# EAGLE design H03 (EAGLE 6.6.0)

## Sheet 1 of 3
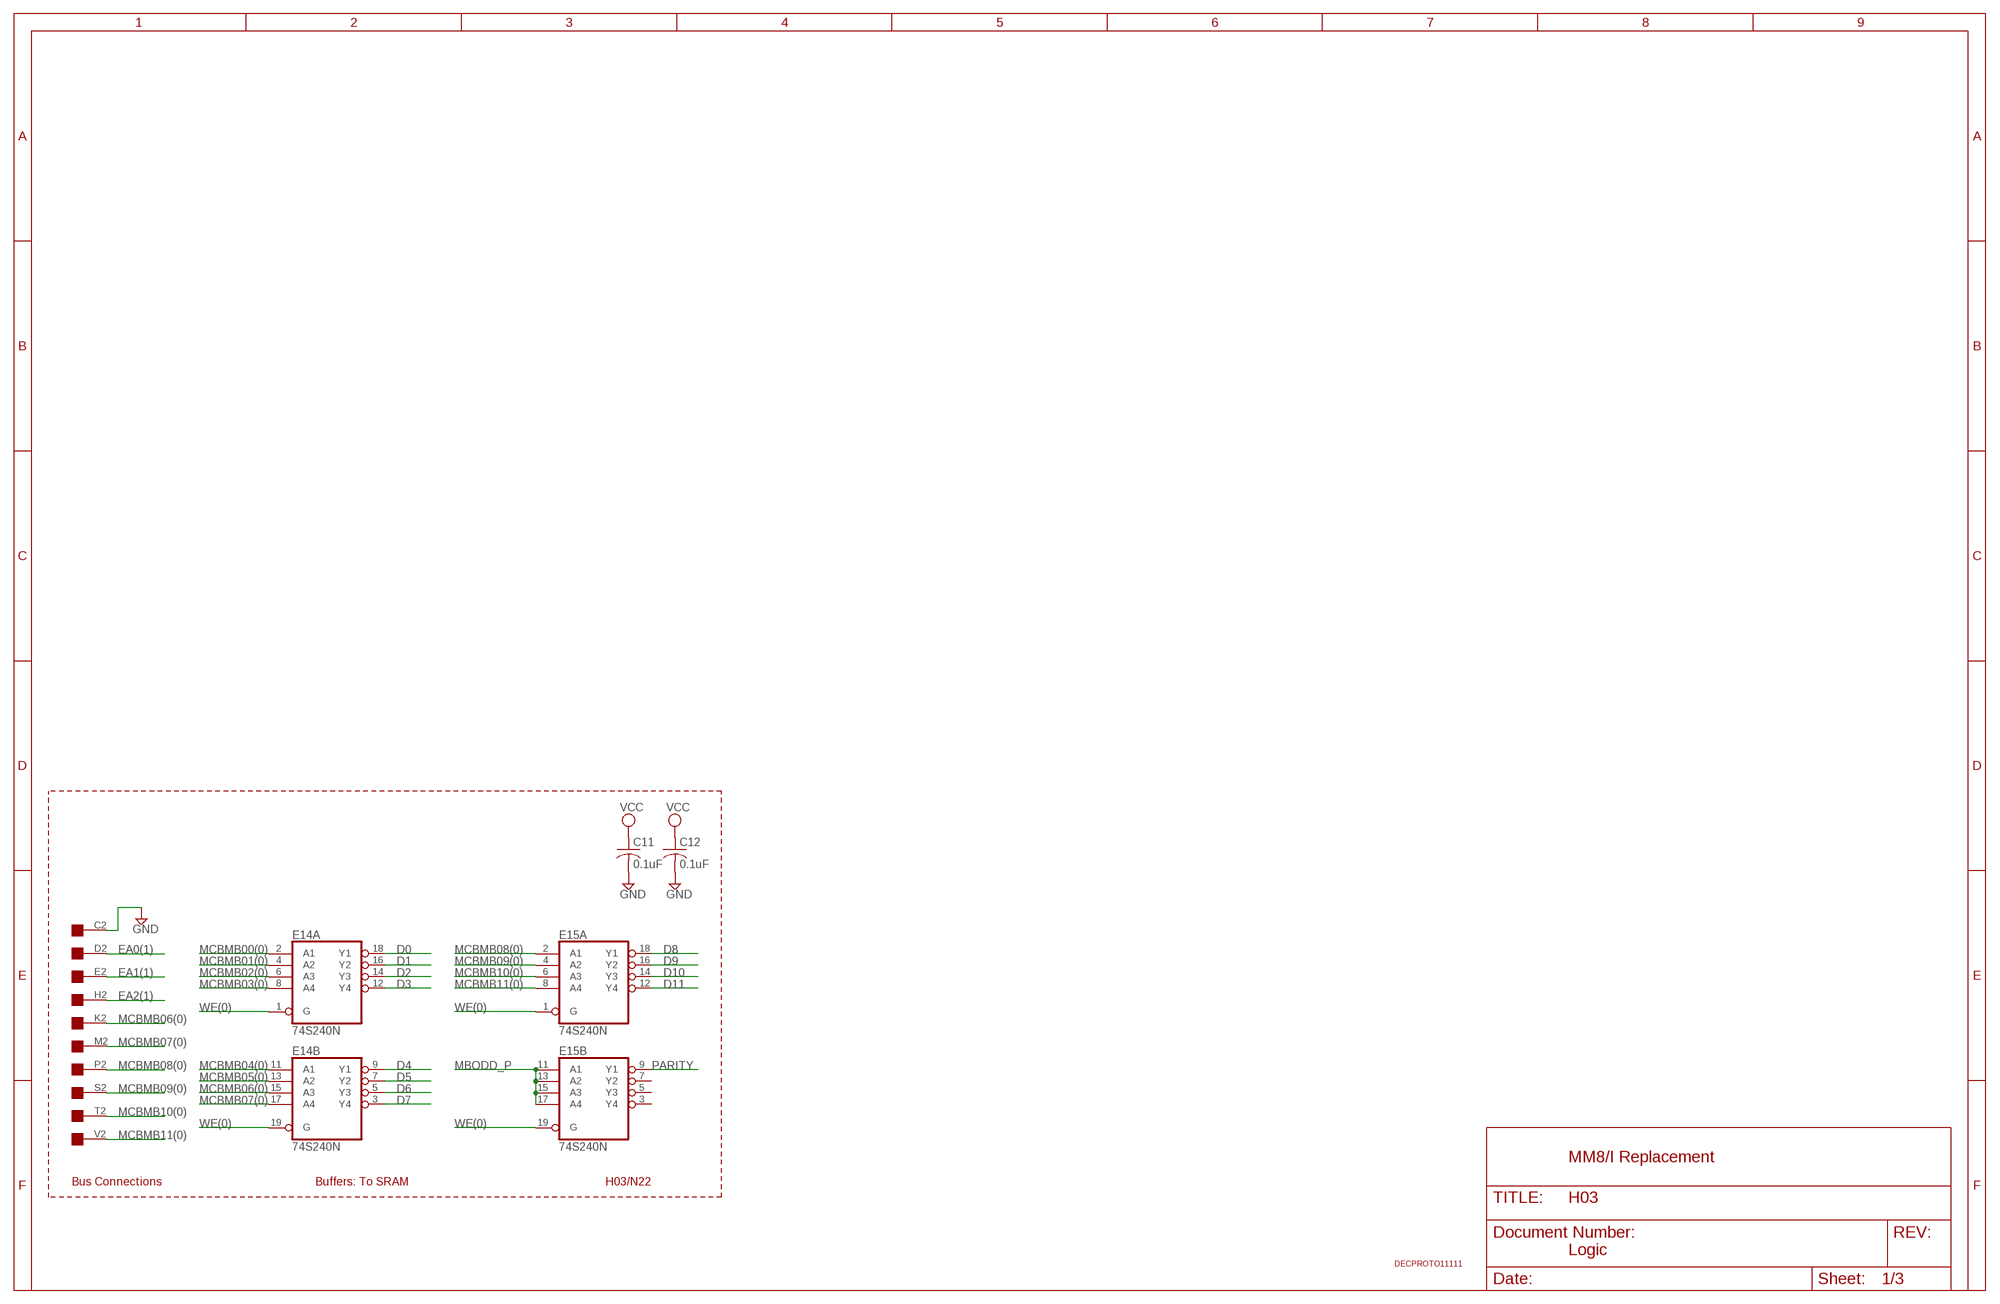
[diagram p0: schematic, sheet 1]

### Parts
C11  0.1uF  C-US050-025X075  [C050-025X075]
C12  0.1uF  C-US050-025X075  [C050-025X075]
E14  74S240N  [DIL20]
E15  74S240N  [DIL20]
H03  EDGE-1  [EDGE-CON1]
U$6  DECPROTO11111  [DECPROTO11111]

### Nets
D0: E14.18(A:Y1) ; also sheet 2
D1: E14.16(A:Y2) ; also sheet 2
D2: E14.14(A:Y3) ; also sheet 2
D3: E14.12(A:Y4) ; also sheet 2
D4: E14.9(B:Y1) ; also sheet 2
D5: E14.7(B:Y2) ; also sheet 2
D6: E14.5(B:Y3) ; also sheet 2
D7: E14.3(B:Y4) ; also sheet 2
D8: E15.18(A:Y1) ; also sheet 2
D9: E15.16(A:Y2) ; also sheet 2
D10: E15.14(A:Y3) ; also sheet 2
D11: E15.12(A:Y4) ; also sheet 2
EA0(1): H03.D2 ; also sheet 2
EA1(1): H03.E2 ; also sheet 2
EA2(1): H03.H2 ; also sheet 2
GND [supply]: C11.2 C12.2 H03.C2 ; also sheet 2
MBODD_P: E15.11(B:A1) E15.13(B:A2) E15.15(B:A3) E15.17(B:A4) ; also sheet 2
MCBMB00(0): E14.2(A:A1) ; also sheet 2
MCBMB01(0): E14.4(A:A2) ; also sheet 2
MCBMB02(0): E14.6(A:A3) ; also sheet 2
MCBMB03(0): E14.8(A:A4) ; also sheet 2
MCBMB04(0): E14.11(B:A1) ; also sheet 2
MCBMB05(0): E14.13(B:A2) ; also sheet 2
MCBMB06(0): E14.15(B:A3) H03.K2
MCBMB07(0): E14.17(B:A4) H03.M2
MCBMB08(0): E15.2(A:A1) H03.P2
MCBMB09(0): E15.4(A:A2) H03.S2
MCBMB10(0): E15.6(A:A3) H03.T2
MCBMB11(0): E15.8(A:A4) H03.V2
PARITY: E15.9(B:Y1) ; also sheet 2
VCC [supply]: C11.1 C12.1 ; also sheet 2
WE(0): E14.1(A:G) E14.19(B:G) E15.1(A:G) E15.19(B:G) ; also sheet 2
Unconnected: E15.3(B:Y4) E15.5(B:Y3) E15.7(B:Y2) H03.A2 H03.B2 H03.F2 H03.J2 H03.L2 H03.N2 H03.R2 H03.U2

### Notes on the sheet
- MM8/I Replacement
- Bus Connections | Buffers: To SRAM | H03/N22
- Logic

## Sheet 2 of 3
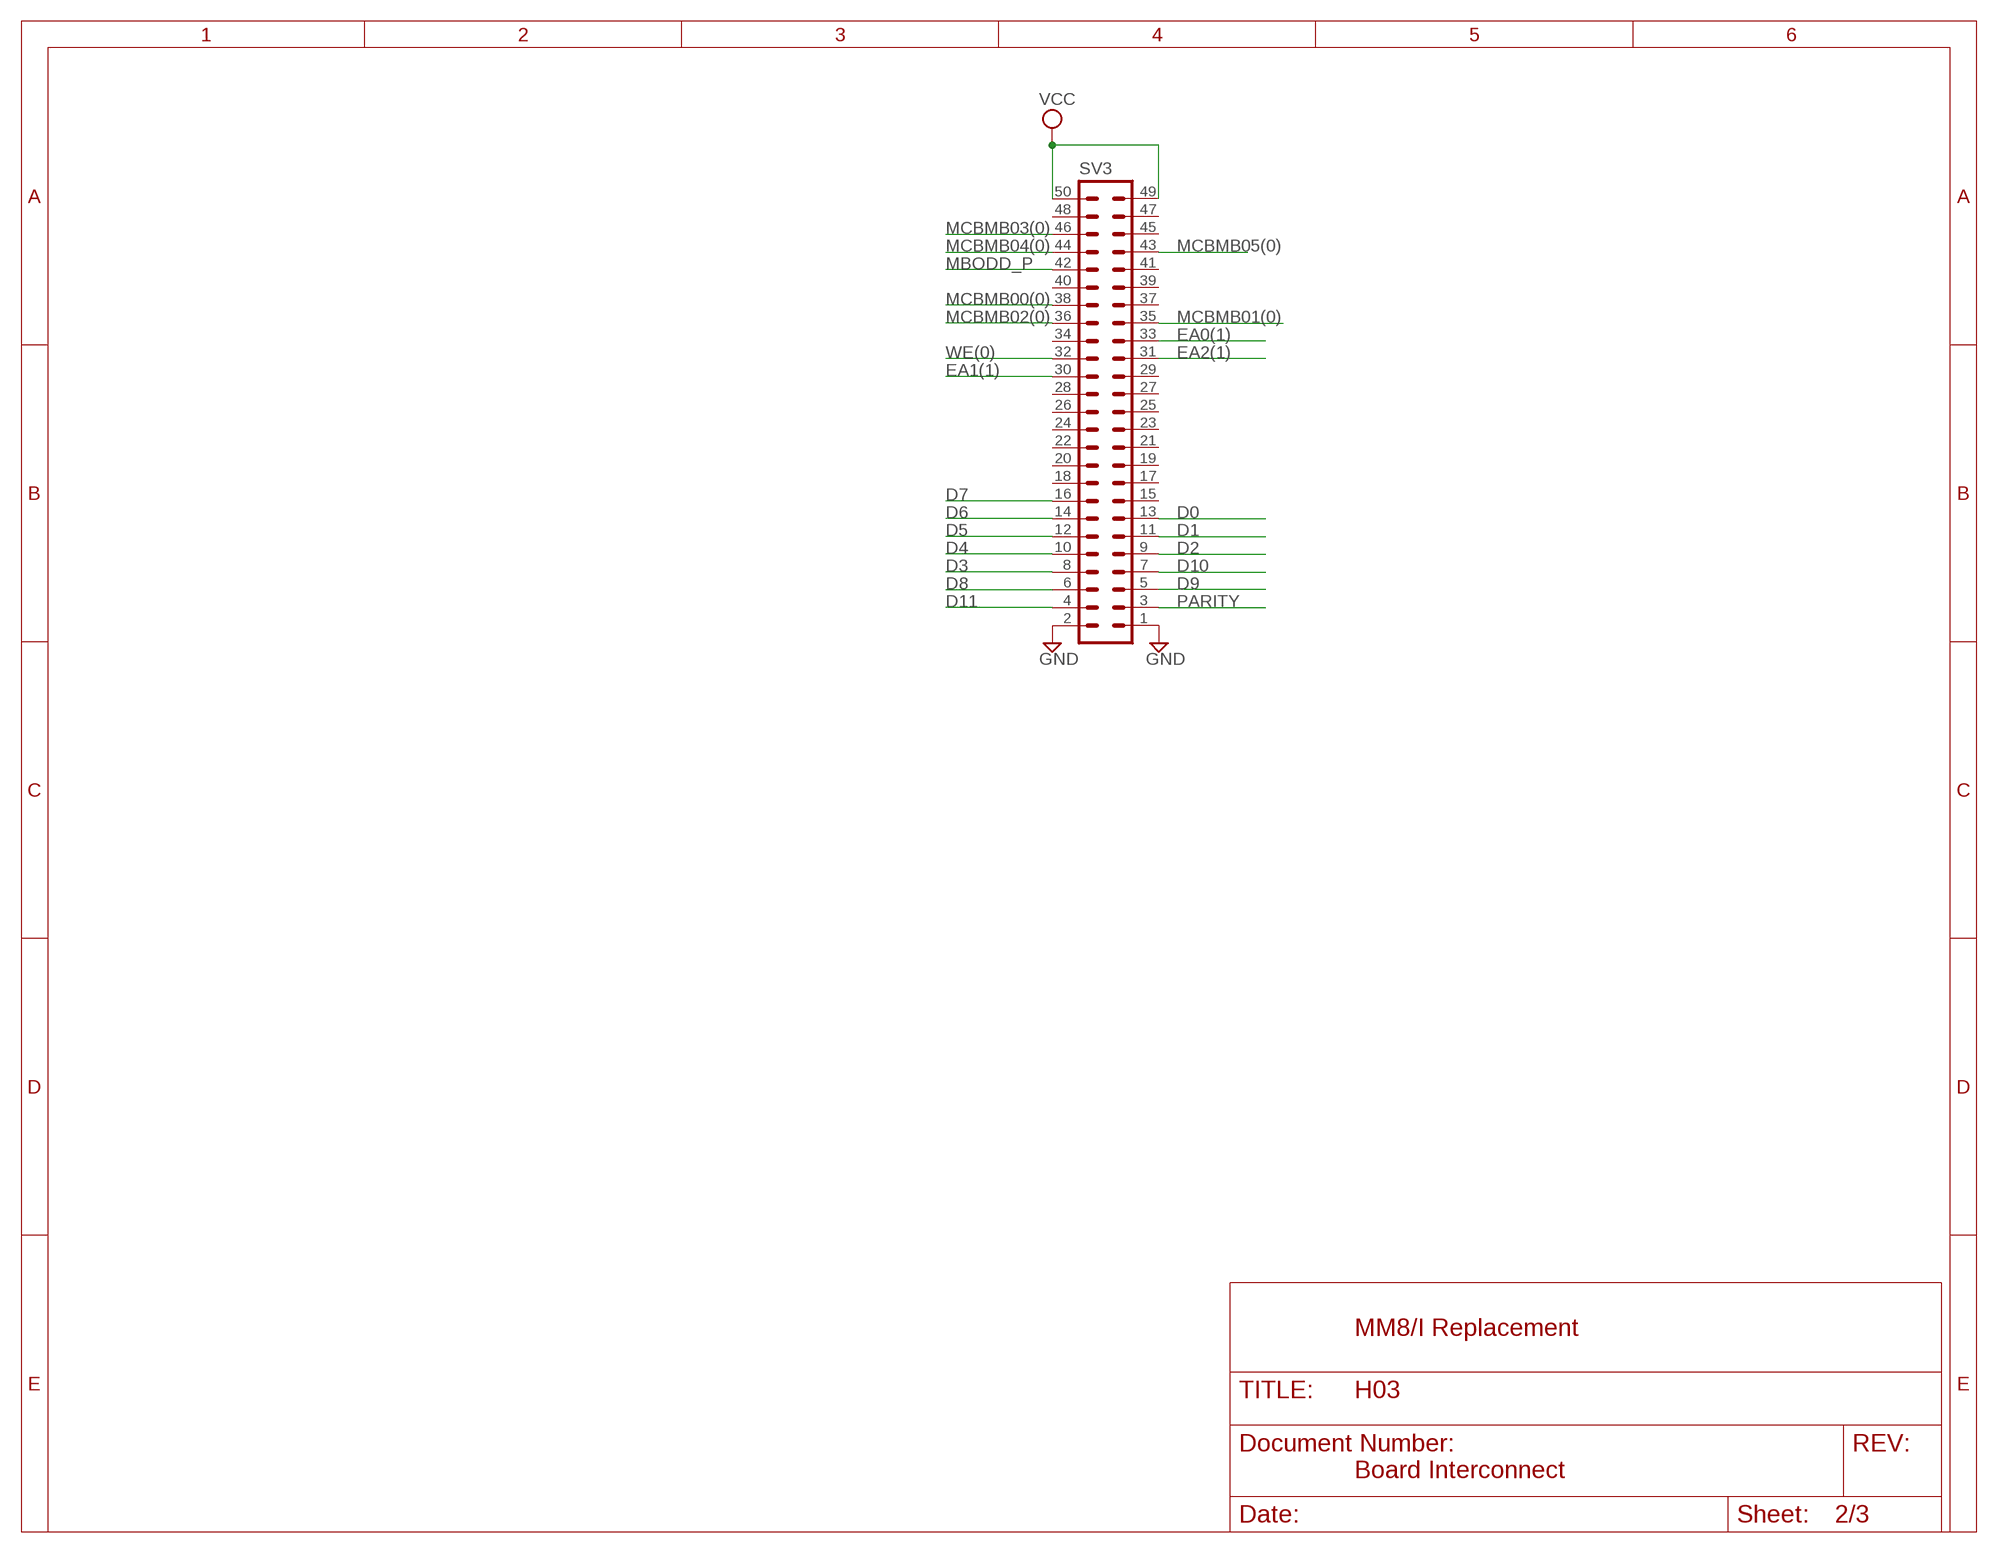
[diagram p1: schematic, sheet 2]

### Parts
SV3  ML50L  [ML50L]

### Nets
D0: SV3.13 ; also sheet 1
D1: SV3.11 ; also sheet 1
D2: SV3.9 ; also sheet 1
D3: SV3.8 ; also sheet 1
D4: SV3.10 ; also sheet 1
D5: SV3.12 ; also sheet 1
D6: SV3.14 ; also sheet 1
D7: SV3.16 ; also sheet 1
D8: SV3.6 ; also sheet 1
D9: SV3.5 ; also sheet 1
D10: SV3.7 ; also sheet 1
D11: SV3.4 ; also sheet 1
EA0(1): SV3.33 ; also sheet 1
EA1(1): SV3.30 ; also sheet 1
EA2(1): SV3.31 ; also sheet 1
GND [supply]: SV3.1 SV3.2 ; also sheet 1
MBODD_P: SV3.42 ; also sheet 1
MCBMB00(0): SV3.38 ; also sheet 1
MCBMB01(0): SV3.35 ; also sheet 1
MCBMB02(0): SV3.36 ; also sheet 1
MCBMB03(0): SV3.46 ; also sheet 1
MCBMB04(0): SV3.44 ; also sheet 1
MCBMB05(0): SV3.43 ; also sheet 1
PARITY: SV3.3 ; also sheet 1
VCC [supply]: SV3.49 SV3.50 ; also sheet 1
WE(0): SV3.32 ; also sheet 1
Unconnected: SV3.15 SV3.17 SV3.18 SV3.19 SV3.20 SV3.21 SV3.22 SV3.23 SV3.24 SV3.25 SV3.26 SV3.27 SV3.28 SV3.29 SV3.34 SV3.37 SV3.39 SV3.40 SV3.41 SV3.45 SV3.47 SV3.48

### Notes on the sheet
- MM8/I Replacement
- Board Interconnect

## Sheet 3 of 3
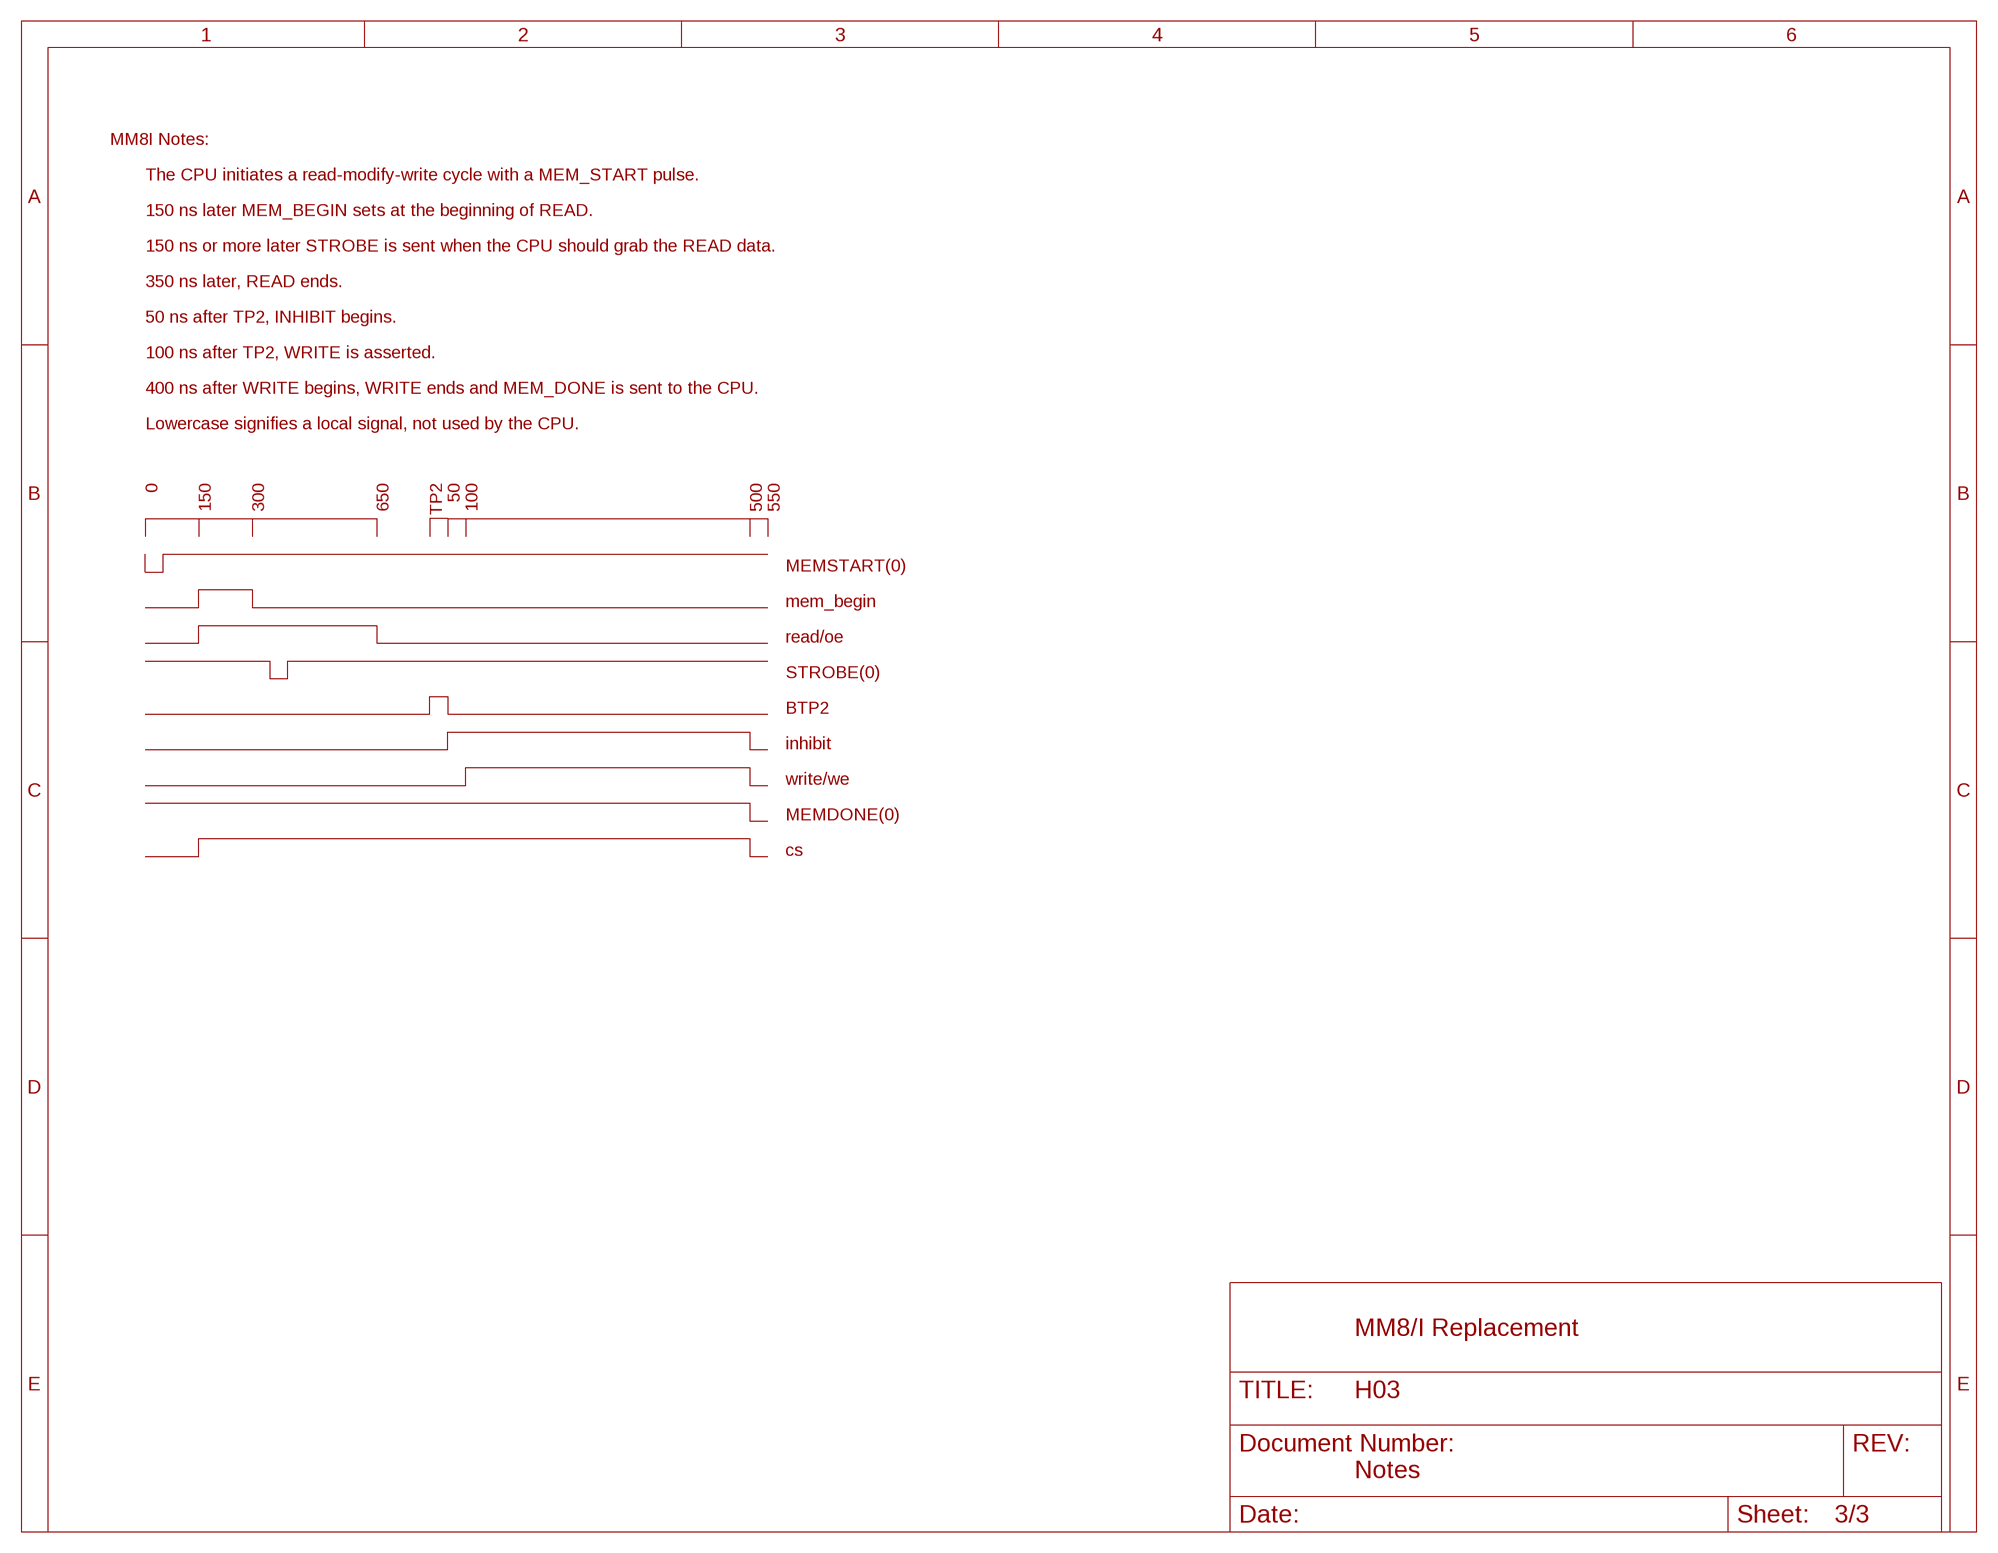
[diagram p2: schematic, sheet 3]

### Notes on the sheet
- MM8I Notes:
- The CPU initiates a read-modify-write cycle with a MEM_START pulse.
- 150 ns later MEM_BEGIN sets at the beginning of READ.
- 150 ns or more later STROBE is sent when the CPU should grab the READ data.
- 350 ns later, READ ends.
- 50 ns after TP2, INHIBIT begins.
- 100 ns after TP2, WRITE is asserted.
- 400 ns after WRITE begins, WRITE ends and MEM_DONE is sent to the CPU.
- Lowercase signifies a local signal, not used by the CPU.
- 0 | 150 | 300 | 650 | TP2 | 50 | 100 | 500 | 550
- MEMSTART(0)
- mem_begin
- read/oe
- STROBE(0)
- BTP2
- inhibit
- write/we
- MEMDONE(0)
- cs
- MM8/I Replacement
- Notes

## Power pins joined to a net without a drawn wire
GND: E14.10(P:GND) E15.10(P:GND)
VCC: E14.20(P:VCC) E15.20(P:VCC)

## Library data of the parts
C11 C12 = rcl:C-US: CAPACITOR, American symbol
E14 E15 = 74xx-us:74*240: Octal BUFFER and LINE DRIVER, 3-state
H03 = dec-con:EDGE-1: Single-Sided DEC Edge Connector -- (side 2)
SV3 = con-ml:ML50L: HARTING; OC_FARNELL: unknown; OC_NEWARK: unknown
U$6 = dec-con:DECPROTO: Various small DEC boards stuck together with break-away tab routing.

## Net classes
1 supply: width 0.711 mm

## Board
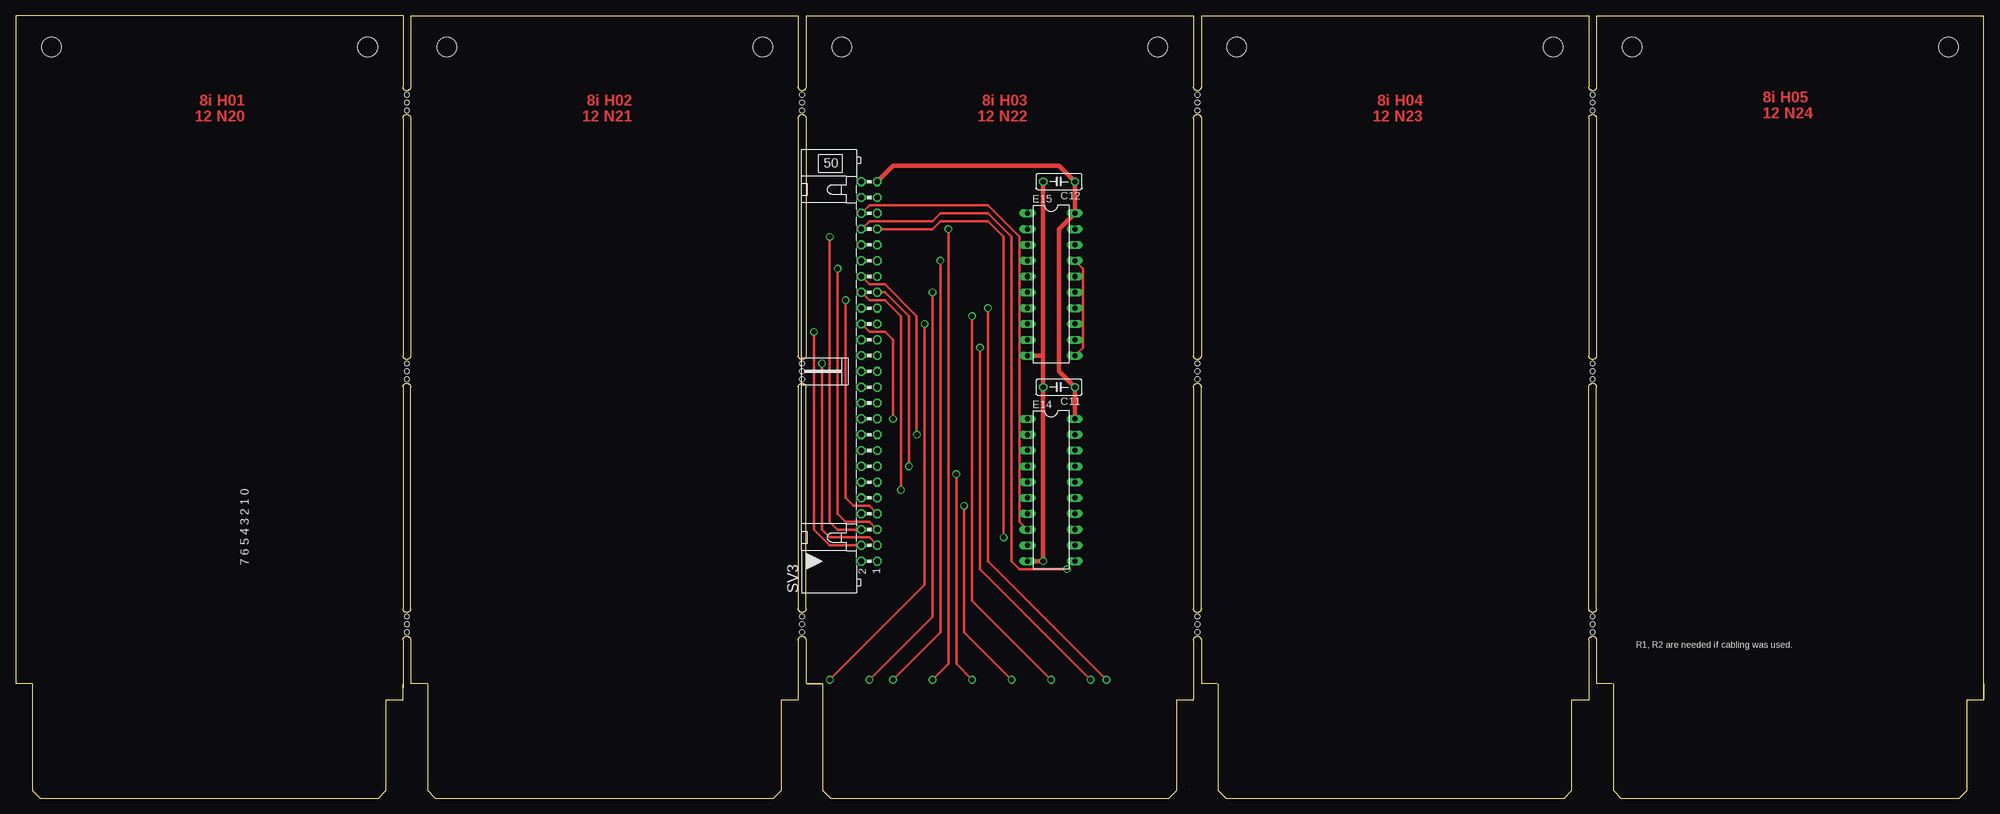
[diagram p3: board, top side]
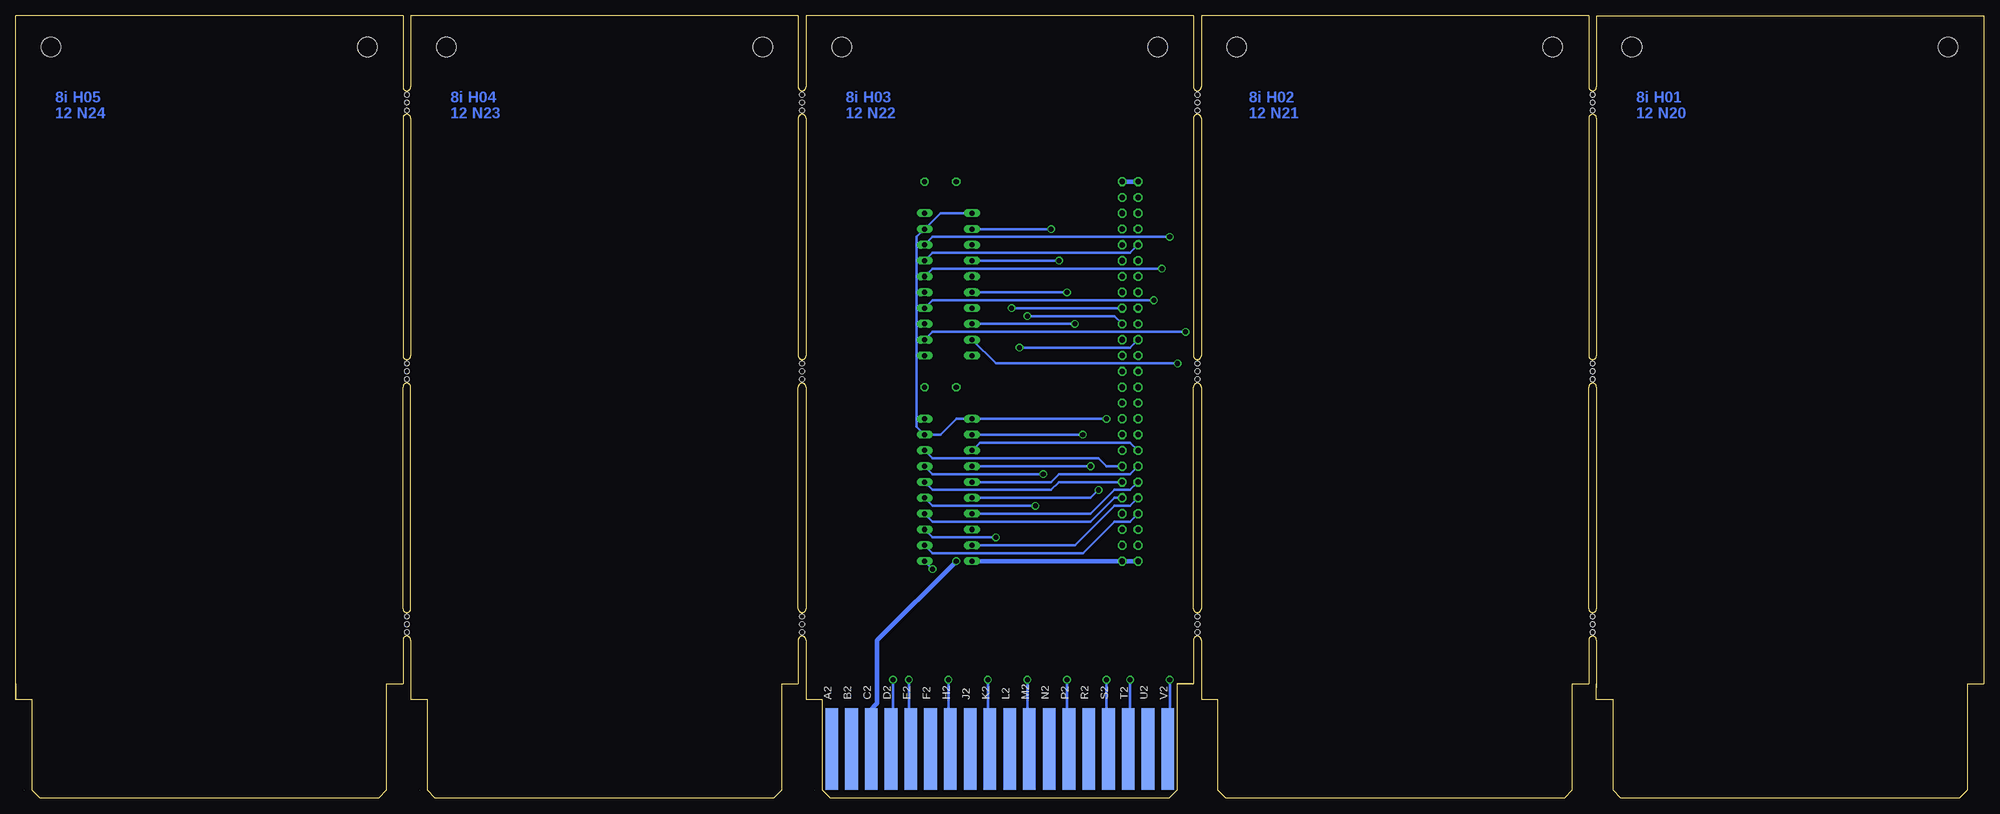
[diagram p4: board, bottom side, seen from below]

Size 316.23 x 125.73 mm. Coordinates in mm from the lower left corner, seen from the top.
Copper layers (1+16): Top 0.035mm / dielectric 1.5mm / Bottom 0.035mm
Design rules "16mils": minimum track width 16mil, minimum drill 32mil, track to track 15mil, track to pad 10mil, pad to pad 10mil, via to via 10mil, smd to smd 10mil, copper to edge 13mil, drill to drill 10mil, minimum pad ring 10mil, minimum via ring 8mil, stop-mask expansion 0mil, vias tented up to drill 0mil, thermal gap 10mil

### Footprints (pad centres in the part's own frame; a part is rotated, then mirrored left to right if it is on the bottom)
C050-025X075 = drill 0.813 octagon: 1 -2.54,0; 2 2.54,0
DIL20 = drill 0.813 long: 1 -11.43,-3.81; 2 -8.89,-3.81; 3 -6.35,-3.81; 4 -3.81,-3.81; 5 -1.27,-3.81; 6 1.27,-3.81; 7 3.81,-3.81; 8 6.35,-3.81; 9 8.89,-3.81; 10 11.43,-3.81; 11 11.43,3.81; 12 8.89,3.81; 13 6.35,3.81; 14 3.81,3.81; 15 1.27,3.81; 16 -1.27,3.81; 17 -3.81,3.81; 18 -6.35,3.81; 19 -8.89,3.81; 20 -11.43,3.81
EDGE-CON1 = smd 13.106 x 2.032 bottom: A2 7.938,4.128; B2 7.938,7.303; C2 7.938,10.477; D2 7.938,13.652; E2 7.938,16.828; F2 7.938,20.003; H2 7.938,23.177; J2 7.938,26.352; K2 7.938,29.527; L2 7.938,32.703; M2 7.938,35.877; N2 7.938,39.053; P2 7.938,42.227; R2 7.938,45.403; S2 7.938,48.578; T2 7.938,51.752; U2 7.938,54.928; V2 7.938,58.102
ML50L = drill 0.914 octagon: 1 -30.48,-1.27; 2 -30.48,1.27; 3 -27.94,-1.27; 4 -27.94,1.27; 5 -25.4,-1.27; 6 -25.4,1.27; 7 -22.86,-1.27; 8 -22.86,1.27; 9 -20.32,-1.27; 10 -20.32,1.27; 11 -17.78,-1.27; 12 -17.78,1.27; 13 -15.24,-1.27; 14 -15.24,1.27; 15 -12.7,-1.27; 16 -12.7,1.27; 17 -10.16,-1.27; 18 -10.16,1.27; 19 -7.62,-1.27; 20 -7.62,1.27; 21 -5.08,-1.27; 22 -5.08,1.27; 23 -2.54,-1.27; 24 -2.54,1.27; 25 0,-1.27; 26 0,1.27; 27 2.54,-1.27; 28 2.54,1.27; 29 5.08,-1.27; 30 5.08,1.27; 31 7.62,-1.27; 32 7.62,1.27; 33 10.16,-1.27; 34 10.16,1.27; 35 12.7,-1.27; 36 12.7,1.27; 37 15.24,-1.27; 38 15.24,1.27; 39 17.78,-1.27; 40 17.78,1.27; 41 20.32,-1.27; 42 20.32,1.27; 43 22.86,-1.27; 44 22.86,1.27; 45 25.4,-1.27; 46 25.4,1.27; 47 27.94,-1.27; 48 27.94,1.27; 49 30.48,-1.27; 50 30.48,1.27
DECPROTO11111 = hole 3.175: 183.515,120.65; 132.715,120.65; 69.266,120.65; 120.066,120.65; 56.566,120.65; 5.766,120.65; 247.015,120.65; 196.215,120.65; 310.515,120.65; 259.715,120.65 | hole 0.813: 62.865,69.85; 62.865,68.58; 62.865,67.31; 62.865,26.67; 62.865,27.94; 62.865,29.21; 62.865,113.03; 62.865,110.49; 62.865,111.76; 126.365,69.85; 126.365,68.58; 126.365,67.31; 126.365,26.67; 126.365,27.94; 126.365,29.21; 126.365,113.03; 126.365,110.49; 126.365,111.76; 189.865,26.67; 189.865,27.94; 189.865,29.21; 189.865,67.31; 189.865,68.58; 189.865,69.85; 189.865,110.49; 189.865,111.76; 189.865,113.03; 253.365,26.67; 253.365,27.94; 253.365,29.21; 253.365,67.31; 253.365,68.58; 253.365,69.85; 253.365,110.49; 253.365,111.76; 253.365,113.03

### Placement (x,y rotation side)
C11  167.64,66.04 180 top
C12  167.64,99.06 180 top
E14  166.37,49.53 270 top
E15  166.37,82.55 270 top
H03  189.23,0 90 top
SV3  137.16,68.58 90 top
U$6  0,0 0 top

### Tracks (layer width: path | path; a pad name or v marks a point on that pad's centre or on a via)
D0
  Bottom 0.406: SV3.13 140.97,53.34 142.24,54.61 168.91,54.61 E14.18
D1
  Bottom 0.406: SV3.11 148.59,50.8 149.86,49.53 168.91,49.53 E14.16
D2
  Bottom 0.406: SV3.9 139.7,48.26 143.51,44.45 168.91,44.45 E14.14
D3
  Bottom 0.406: E14.12 168.91,39.37 144.78,39.37 139.7,44.45 137.16,44.45 SV3.8
D4
  Bottom 0.406: E14.9 146.05,40.64 139.7,46.99 137.16,46.99 SV3.10
D5
  Bottom 0.406: SV3.12 137.16,49.53 139.7,49.53 143.51,45.72 E14.7
D6
  Bottom 0.406: SV3.14 137.16,52.07 148.59,52.07 149.86,50.8 E14.5
D7
  Bottom 0.406: SV3.16 137.16,57.15 161.29,57.15 E14.3
D8  (via drill 0.81)
  Top 0.406: SV3.6 132.08,43.18 130.81,44.45 v130.81,90.17
  Bottom 0.406: E15.18 168.91,90.17 v130.81,90.17
D9  (via drill 0.81)
  Top 0.406: SV3.5 137.16,44.45 133.35,44.45 132.08,45.72 v132.08,85.09
  Bottom 0.406: E15.16 168.91,85.09 v132.08,85.09
D10  (via drill 0.81)
  Top 0.406: SV3.7 137.16,46.99 134.62,46.99 133.35,48.26 v133.35,80.01
  Bottom 0.406: E15.14 168.91,80.01 v133.35,80.01
D11  (via drill 0.81)
  Top 0.406: SV3.4 130.81,40.64 128.27,43.18 v128.27,74.93
  Bottom 0.406: E15.12 168.91,74.93 v128.27,74.93
EA0(1)  (via drill 0.81)
  Top 0.406: v156.21,78.74 156.21,38.1 v175.26,19.05
  Bottom 0.406: H03.D2 175.58,8.57 175.26,8.89 v175.26,19.05 | SV3.33 v156.21,78.74
EA1(1)  (via drill 0.81)
  Top 0.406: v154.94,72.39 154.94,36.83 v172.72,19.05
  Bottom 0.406: H03.E2 172.4,8.57 172.72,8.89 v172.72,19.05 | v154.94,72.39 137.16,72.39 SV3.30
EA2(1)  (via drill 0.81)
  Top 0.406: v153.67,77.47 153.67,31.75 v166.37,19.05
  Bottom 0.406: H03.H2 166.05,8.57 166.37,8.89 v166.37,19.05 | SV3.31 139.7,77.47 v153.67,77.47
GND  (via drill 0.81)
  Top 0.711: E15.10 165.1,71.12 | 165.1,71.12 C11.2 v165.1,38.1 E14.10 | C12.2 165.1,71.12
  Bottom 0.711: H03.C2 178.75,8.57 179.07,8.89 179.07,13.97 177.8,15.24 177.8,25.4 v165.1,38.1 | SV3.2 SV3.1 E14.10
MBODD_P
  Top 0.406: E15.11 171.45,72.39 171.45,76.2 | 171.45,76.2 171.45,81.28 | 171.45,81.28 171.45,85.09 E15.17 | E15.15 171.45,81.28 | E15.13 171.45,76.2
  Bottom 0.406: SV3.42 137.16,87.63 168.91,87.63 E15.17
MCBMB00(0)  (via drill 0.81)
  Top 0.406: SV3.38 137.16,82.55 139.7,82.55 144.78,77.47 v144.78,58.42
  Bottom 0.406: v144.78,58.42 E14.2
MCBMB01(0)  (via drill 0.81)
  Top 0.406: SV3.35 139.7,81.28 143.51,77.47 v143.51,53.34
  Bottom 0.406: v143.51,53.34 E14.4
MCBMB02(0)  (via drill 0.81)
  Top 0.406: SV3.36 137.16,80.01 139.7,80.01 142.24,77.47 v142.24,49.53
  Bottom 0.406: E14.6 143.51,48.26 v142.24,49.53
MCBMB03(0)
  Top 0.406: E14.8 161.29,44.45 161.29,90.17 156.21,95.25 137.16,95.25 SV3.46
MCBMB04(0)  (via drill 0.81)
  Top 0.406: v168.91,36.83 161.29,36.83 160.02,38.1 160.02,90.17 156.21,93.98 148.59,93.98 147.32,92.71 137.16,92.71 SV3.44
  Bottom 0.406: E14.11 v168.91,36.83
MCBMB05(0)  (via drill 0.81)
  Top 0.406: v158.75,41.91 158.75,90.17 156.21,92.71 148.59,92.71 147.32,91.44 SV3.43
  Bottom 0.406: E14.13 168.91,41.91 v158.75,41.91
MCBMB06(0)  (via drill 0.81)
  Top 0.406: v152.4,46.99 152.4,26.67 v160.02,19.05
  Bottom 0.406: H03.K2 159.7,8.57 160.02,8.89 v160.02,19.05 | v152.4,46.99 168.91,46.99 E14.15
MCBMB07(0)  (via drill 0.81)
  Top 0.406: v151.13,52.07 151.13,21.59 v153.67,19.05
  Bottom 0.406: H03.M2 153.35,8.57 153.67,8.89 v153.67,19.05 | v151.13,52.07 168.91,52.07 E14.17
MCBMB08(0)  (via drill 0.81)
  Top 0.406: v149.86,91.44 149.86,21.59 v147.32,19.05
  Bottom 0.406: H03.P2 147,8.57 147.32,8.89 v147.32,19.05 | v149.86,91.44 E15.2
MCBMB09(0)  (via drill 0.81)
  Top 0.406: v148.59,86.36 148.59,26.67 v140.97,19.05
  Bottom 0.406: H03.S2 140.65,8.57 140.97,8.89 v140.97,19.05 | v148.59,86.36 E15.4
MCBMB10(0)  (via drill 0.81)
  Top 0.406: v147.32,81.28 147.32,29.21 v137.16,19.05
  Bottom 0.406: v147.32,81.28 E15.6 | H03.T2 137.16,8.26 v137.16,19.05
MCBMB11(0)  (via drill 0.81)
  Top 0.406: v146.05,76.2 146.05,34.29 v130.81,19.05
  Bottom 0.406: H03.V2 131.13,8.57 130.81,8.89 v130.81,19.05 | v146.05,76.2 E15.8
PARITY  (via drill 0.81)
  Top 0.406: SV3.3 137.16,41.91 130.81,41.91 129.54,43.18 v129.54,69.85
  Bottom 0.406: E15.9 158.75,69.85 v129.54,69.85
VCC
  Top 0.711: E14.20 C11.1 167.64,68.58 167.64,91.44 E15.20 C12.1 167.64,101.6 140.97,101.6 SV3.49
  Bottom 0.711: SV3.50 SV3.49
WE(0)  (via drill 0.81)
  Top 0.406: SV3.32 137.16,74.93 139.7,74.93 140.97,73.66 v140.97,60.96
  Bottom 0.406: E15.1 167.64,93.98 E15.19 171.45,90.17 171.45,59.69 E14.19 167.64,58.42 165.1,60.96 E14.1 v140.97,60.96

### Text on the board
Top: 8i H01 | 8i H02 | 8i H03 | 8i H04 | 8i H05 | 12 N20 | 12 N21 | 12 N22 | 12 N23 | 12 N24
Bottom: 8i H01 | 8i H02 | 8i H03 | 8i H04 | 8i H05 | 12 N20 | 12 N21 | 12 N22 | 12 N23 | 12 N24
tPlace: 7 6 5 4 3 2 1 0 | R1, R2 are needed if cabling was used.
tValues: 8i H01 | 8i H02 | 8i H03 | 8i H04 | 8i H05 | 12 N20 | 12 N21 | 12 N22 | 12 N23 | 12 N24 | VCC | GND